# Altium schematic sheet other.SchDoc
size A2; SheetNumber: 3; SheetTotal: 3
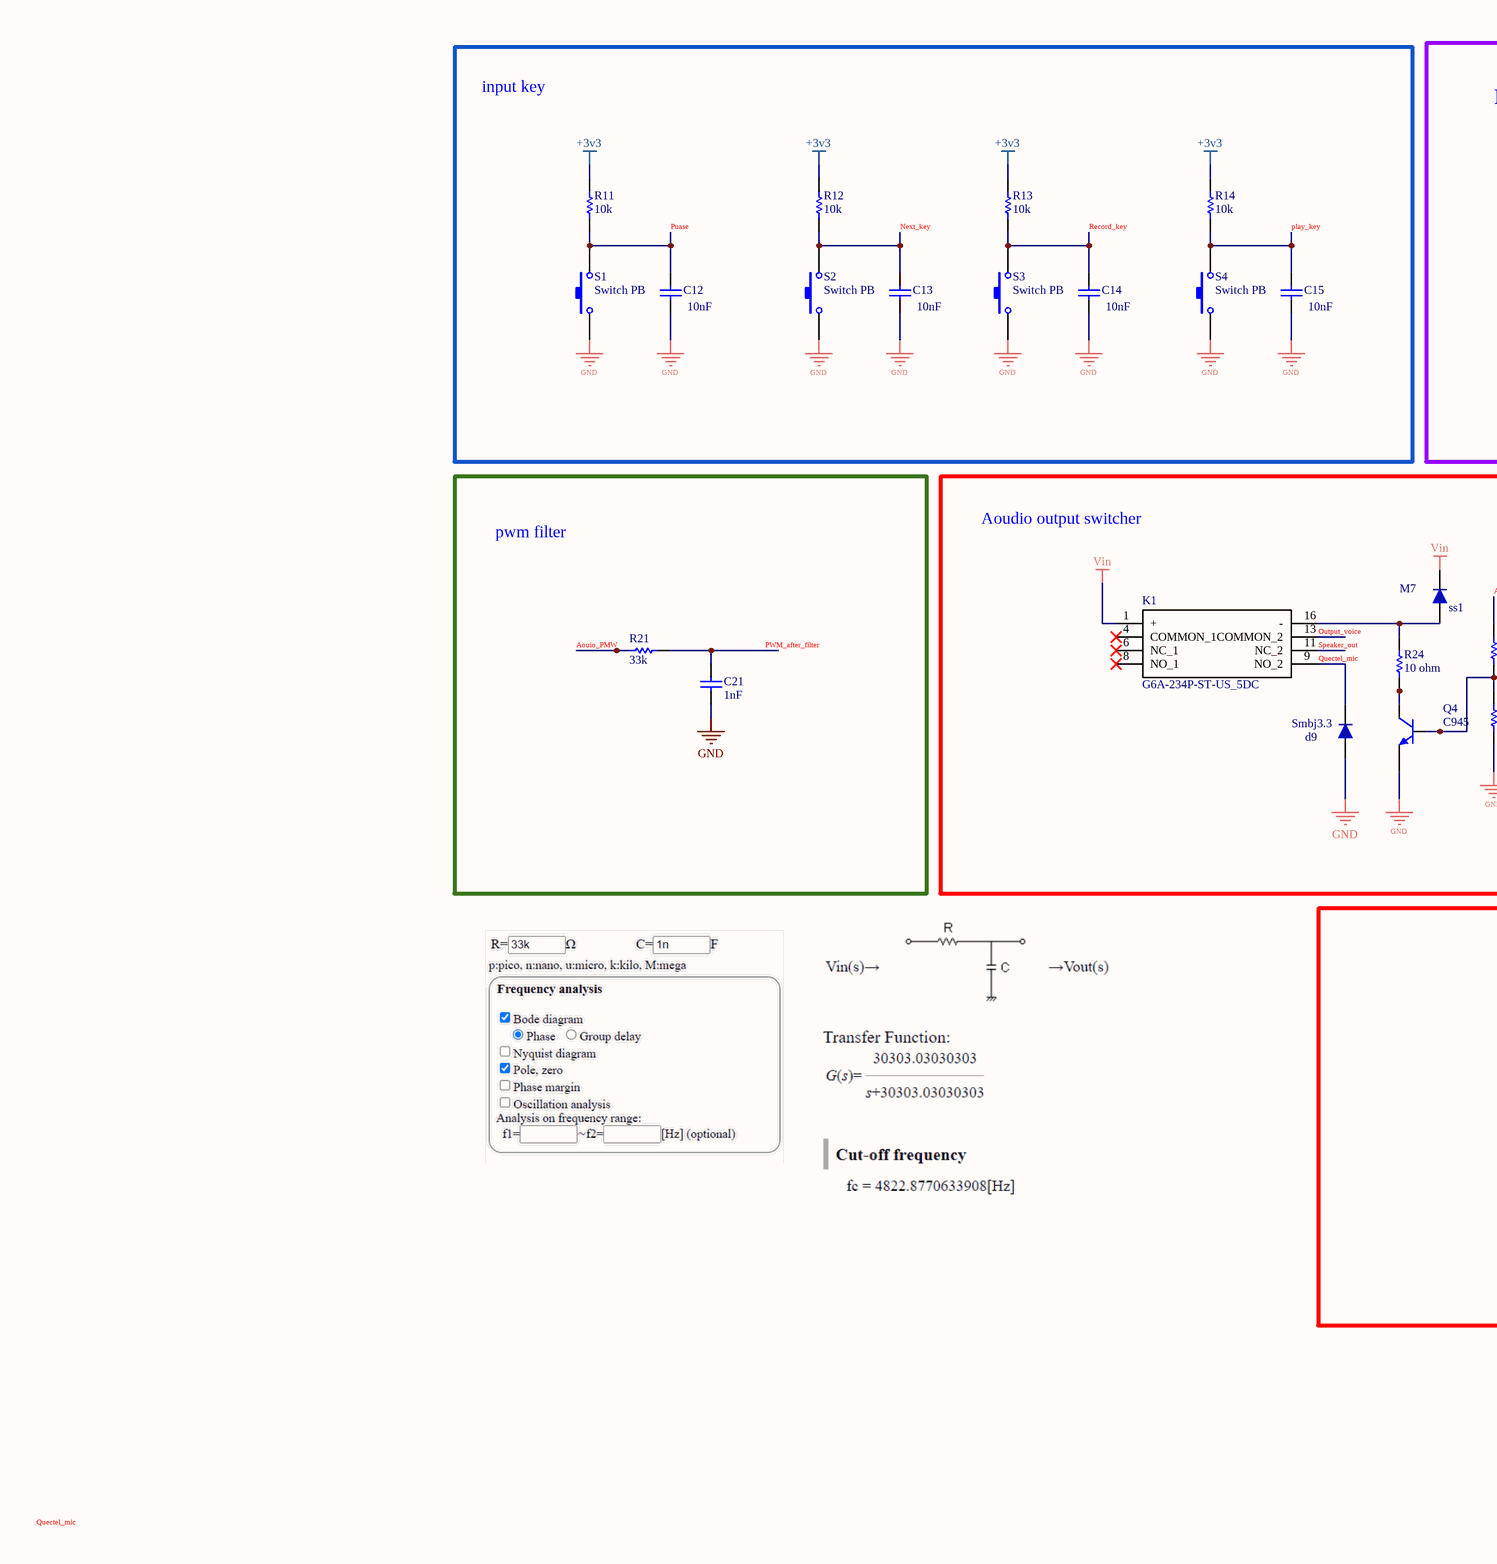
[diagram p0: other.SchDoc, left]
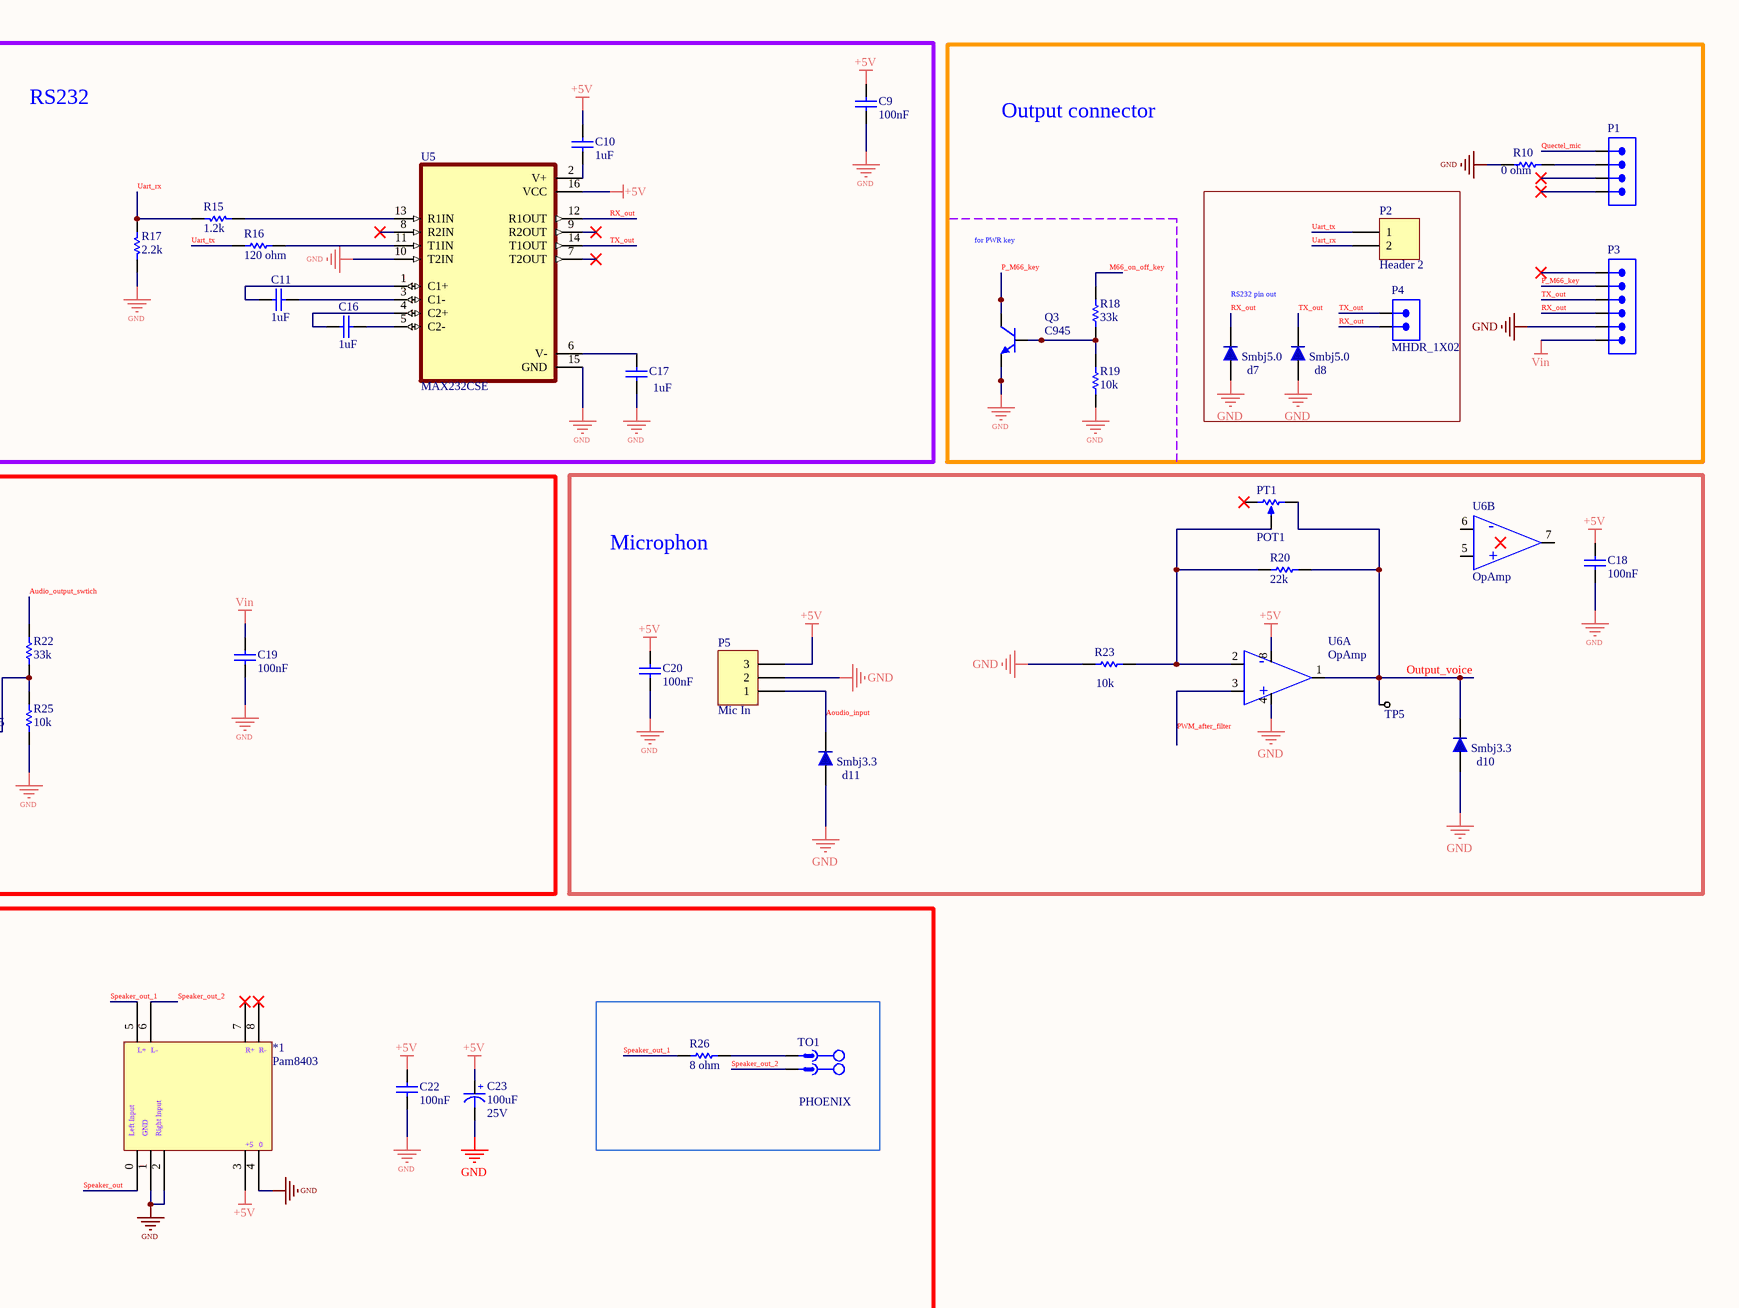
[diagram p1: other.SchDoc, right]

## Parts
*1  Pam8403  [PAM8403]
C9  value 100nF  [CAP805]
C10  value 1uF  [CAP805]
C11  value 1uF  [CAP805]
C12  value 10nF  [CAP805]
C13  value 10nF  [CAP805]
C14  value 10nF  [CAP805]
C15  value 10nF  [CAP805]
C16  value 1uF  [CAP805]
C17  value 1uF  [CAP805]
C18  value 100nF  [CAP805]
C19  value 100nF  [CAP805]
C20  value 100nF  [CAP805]
C21  value 1nF  [CAP805]
C22  value 100nF  [CAP805]
C23  Voltage: 25V  [cap 03]  (hidden comment: 100uF)
d7  Smbj5.0  [DIODE SMA (DO-214AC)]
d8  Smbj5.0  [DIODE SMA (DO-214AC)]
d9  Smbj3.3  [DIODE SMA (DO-214AC)]
d10  Smbj3.3  [DIODE SMA (DO-214AC)]
d11  Smbj3.3  [DIODE SMA (DO-214AC)]
K1  G6A-234P-ST-US_5DC  [G6A234PSTUS5DC]
P1  xh 4pin  [XH 4 PIN-S]  (value not drawn)
P2  Header 2  [HDR1X2]
P3  xh 6pin  [XH 6 PIN-S]  (value not drawn)
P4  MHDR_1X02  [MHDR1X02-254P]
P5  Mic In  [HDR1X3]
PT1  POT1  [POT1]
Q3  C945  [C945]
Q4  C945  [C945]
R10  0 ohm  [RES0805]
R11  10k  [RES0805]
R12  10k  [RES0805]
R13  10k  [RES0805]
R14  10k  [RES0805]
R15  1.2k  [RES0805]
R16  120 ohm  [RES0805]
R17  2.2k  [RES0805]
R18  33k  [RES0805]
R19  10k  [RES0805]
R20  22k  [RES0805]
R21  33k  [RES0805]
R22  33k  [RES0805]
R23  10k  [RES0805]
R24  10 ohm  [RES0805]
R25  10k  [RES0805]
R26  8 ohm  [RES0805]
S1  Switch PB  [Switch - Push to On]
S2  Switch PB  [Switch - Push to On]
S3  Switch PB  [Switch - Push to On]
S4  Switch PB  [Switch - Push to On]
ss1  M7  [DIODE SMA (DO-214AC)]
TO1  PHOENIX  [CON_MSTBA02]
TP5  (no value)  [TP10]
U5  MAX232CSE  [SOIC127P600X175-16N]
U6  OpAmp  [DIP8]  (parts A,B of 2)

## Blocks framed on the sheet
RS232: C9-C11 C16 C17 R15-R17 U5
input key: C12-C15 R11-R14 S1-S4
Output connector: P1 P3 Q3 R10 R18 R19
RS232 pin out: d7 d8 P2 P4
Microphon: C18 C20 d10 d11 P5 PT1 R20 R23 TP5 U6
pwm filter: C21 R21
Aoudio output switcher: C19 d9 K1 Q4 R22 R24 R25 ss1

## Nets
+3v3: R11.2 R12.2 R13.2 R14.2
+5V: *1.3 C9.1 C10.1 C18.1 C20.1 C22.1 C23.1(+) P5.3 U5.16(VCC) U6.8(V+)
GND: *1.1 *1.2 *1.4 C9.2 C12.1 C13.1 C14.1 C15.1 C17.1 C18.2 C19.2 C20.2 C21.2 C22.2 C23.2(-) d7.1 d8.1 d9.1 d10.1 d11.1 P3.5 P5.2 Q3.1(E) Q4.1(E) R10.2 R17.1 R19.2 R23.2 R25.2 S1.1 S2.1 S3.1 S4.1 U5.10(T2IN) U5.15(GND) U6.4(V-)
Vin: C19.1 K1.1(+) P3.6 ss1.2
Aoudio_input: d11.2 P5.1
Aouio_PMW: R21.2
Audio_output_swtich: R22.1
M66_on_off_key: R18.1
Next_key: C13.2 R12.1 S2.2
Output_voice: d10.2 K1.13(COMMON_2) PT1.2(BOT) R20.1 TP5.1(TP) U6.1(Output)
P_M66_key: P3.2 Q3.2(C)
play_key: C15.2 R14.1 S4.2
Puase: C12.2 R11.1 S1.2
PWM_after_filter: C21.1 R21.1 U6.3(Noninverter_Input)
Quectel_mic: d9.2 K1.9(NO_2) P1.1
Record_key: C14.2 R13.1 S3.2
RX_out: d7.2 P3.4 P4.2 U5.12(R1OUT)
Speaker_out: *1.0 K1.11(NC_2)
Speaker_out_1: *1.5 R26.1
Speaker_out_2: *1.6 TO1.2
TX_out: d8.2 P3.3 P4.1 U5.14(T1OUT)
Uart_rx: P2.2 R15.1 R17.2
Uart_tx: P2.1 R16.2
NetC10_2: C10.2 U5.2(V+)
NetC11_1: C11.1 U5.3(C1-)
NetC11_2: C11.2 U5.1(C1+)
NetC16_1: C16.1 U5.5(C2-)
NetC16_2: C16.2 U5.4(C2+)
NetC17_2: C17.2 U5.6(V-)
NetK1_16: K1.16(-) R24.1 ss1.1
NetP1_2: P1.2 R10.1
NetPT1_3: PT1.3(TAP) R20.2 R23.1 U6.2(Inverter_Input)
NetQ3_3: Q3.3(B) R18.2 R19.1
NetQ4_2: Q4.2(C) R24.2
NetQ4_3: Q4.3(B) R22.2 R25.1
NetR15_2: R15.2 U5.13(R1IN)
NetR16_1: R16.1 U5.11(T1IN)
NetR26_2: R26.2 TO1.1

Not connected (* = marked no-connect by the designer): *1 7* 8*; K1 4(COMMON_1)* 6(NC_1)* 8(NO_1)*; P1 3* 4*; P3 1*; PT1 1(TOP)*; U5 7(T2OUT)* 8(R2IN)* 9(R2OUT)*; U6 5(Noninverter_Input) 6(Inverter_Input) 7(Output)

## Notes on the sheet
- for PWR key
- Labels drawn without touching a wire or pin: Quectel_mic
- (in symbol OpAmp, part A) -; +
- (in symbol OpAmp, part B) -; +
- (in symbol Pam8403) L+; L-; R+; R-; Left Input; GND; Right Input; +5

## Library data of the parts
C9-C22 = Cap: Capacitor; Published: 8-Jun-2000; LatestRevisionDate: 17-Jul-2002; LatestRevisionNote: Re-released for DXP Platform.; Publisher: Altium Limited
C23 = CAP_Polar: Polar Capacitor; Designer: Eng. Saeid Jorablo; Company: SJ Libraries; ComponentLink1Description: Datasheet; ComponentLink2Description: Reference; Publisher: SJ Unlimited; Mounting Technology: Surface Mount\Through-Hole; HelpURL: http://s3.picofile.com/file/7443264187/Coming_Soon_logo.gif; Status: Unreleased; Value: 100uF
d7 d8 = 1n4007 SMD M7: Part. No: M7; Manufacturer: DC COMPONENTS; Designer: Abbas Basereh; Link: http://www.tme.eu/en/details/m7/smd-universal-diodes/dc-components/; Link: https://www.aliexpress.com/item/Smd-tube-1n4007-m7-SMA/1213719741.html?spm=2114.01010208.3.1.ZyZ7bC&ws_ab_test=searchweb0_0,searchweb201602_4_10065_10068_10084_10083_10080_10082_10081_10060_10061_10062_10056_10055_10054_10059_10099_10078_10079_427_10073_10103_10102_10096_10052_10050_10051,searchweb201603_4&btsid=db2be5ca-e560-400a-b91c-484ab5ee228b; Data: 16-12-2016
d9-d11 = 1n4007 SMD M7: Smbj5.0; Part. No: M7; Manufacturer: DC COMPONENTS; Designer: Abbas Basereh; Link: http://www.tme.eu/en/details/m7/smd-universal-diodes/dc-components/; Link: https://www.aliexpress.com/item/Smd-tube-1n4007-m7-SMA/1213719741.html?spm=2114.01010208.3.1.ZyZ7bC&ws_ab_test=searchweb0_0,searchweb201602_4_10065_10068_10084_10083_10080_10082_10081_10060_10061_10062_10056_10055_10054_10059_10099_10078_10079_427_10073_10103_10102_10096_10052_10050_10051,searchweb201603_4&btsid=db2be5ca-e560-400a-b91c-484ab5ee228b; Data: 16-12-2016
K1 = G6A-234P-ST-US_5DC: Relay or Contactor; Manufacturer_Name: Omron Electronics; Manufacturer_Part_Number: G6A-234P-ST-US 5DC; Datasheet Link: https://componentsearchengine.com/Datasheets/2/G6A-234P-ST-US 5DC.pdf; Height: 8.4mm; Arrow Part Number: G6A-234P-ST-US 5DC; Arrow Price/Stock: https://www.arrow.com/en/products/g6a234pstus5dc/omron
P1 = MHDR_1X04
P2 = Header 2: Header, 2-Pin; LatestRevisionDate: 17-Jul-2002; LatestRevisionNote: Re-released for DXP Platform.; Publisher: Altium Limited
P3 = MHDR_1X06
P4 = MHDR_1X02: Male Header 1X02
P5 = Header 3: Header, 3-Pin; LatestRevisionDate: 17-Jul-2002; LatestRevisionNote: Re-released for DXP Platform.; Publisher: Altium Limited
PT1 = POT1: Variable Potentiometer standing; Designer: Seyed Mohsen Ghasemian; WEB: www.picpars.com
Q3 Q4 = C945 2: NPN Transistor; Designer: Saeid Jorablo; Company: IPA CO; Last Update Time: 2008/08/04; Value: C945
R10 R18 R19 R22 R24-R26 = RES 0805 0.125W_5: RES 0805; Designer: Abbas Basereh; Desc.: RES SMD 0805; Data: 16-12-2016
R11-R17 R20 R21 R23 = RES 0805 0.125W_1: RES 0805; Designer: Abbas Basereh; Desc.: RES SMD 0805; Data: 16-12-2016
S1-S4 = Switch PB: Push Button Switch
ss1 = 1n4007 SMD M7: Standard Rectifiers; Manufacturer: DC COMPONENTS; Designer: Abbas Basereh; Link: http://www.tme.eu/en/details/m7/smd-universal-diodes/dc-components/; Part. No: M7; Link: https://www.aliexpress.com/item/Smd-tube-1n4007-m7-SMA/1213719741.html?spm=2114.01010208.3.1.ZyZ7bC&ws_ab_test=searchweb0_0,searchweb201602_4_10065_10068_10084_10083_10080_10082_10081_10060_10061_10062_10056_10055_10054_10059_10099_10078_10079_427_10073_10103_10102_10096_10052_10050_10051,searchweb201603_4&btsid=db2be5ca-e560-400a-b91c-484ab5ee228b; Data: 16-12-2016
TO1 = CON_Phoenix_MSTB_02: 2 Pitch: 5.08 mm Color: green Contact surface: Tin Assembly; Manufacturer: PHOENIX CONTACT; Connector type: PCB Terminal Block; designer: ABBAS BASEREH; Max Current: 12 A; Positions: 2; Voltage: 320 V; Category: Connector; ComponentLink1Description: Header, Nominal current: 12 A Rated voltage (III/2): 320 V Number of positions: 2 Pitch: 5.08 mm Color: green Contact surface: Tin Assembly: Soldering  DESIGNER:ABBAS BASEREH; ComponentLink2Description: Reference; Mounting Technology: Through-Hole; Pin Count: 2; Revision 1: 2017-3-1; Status: Unreleased; PART.NO: PHOENIX
TP5 = Test Point: Company: SJ Libraries; Designer: Eng. Saeid Jorablo; Mounting Technology: Surface Mount\Through-Hole; ComponentLink1Description: Datasheet; Pin Count: 0; Update Date: 6/3/2012; Category: MISC; HelpURL: http://s3.picofile.com/file/7443264187/Coming_Soon_logo.gif
U5 = MAX232CSE: MF: {'manufacturer': u'Analog Devices'}; Package: None; Price: None; Value: *; MP: MAX232CSE; Availability: Unavailable
U6 = OpAmp: Dual Low Noise Operational Amplifier (OpAmp)